# Altium schematic sheet pll_ADF4351.SchDoc
size A3
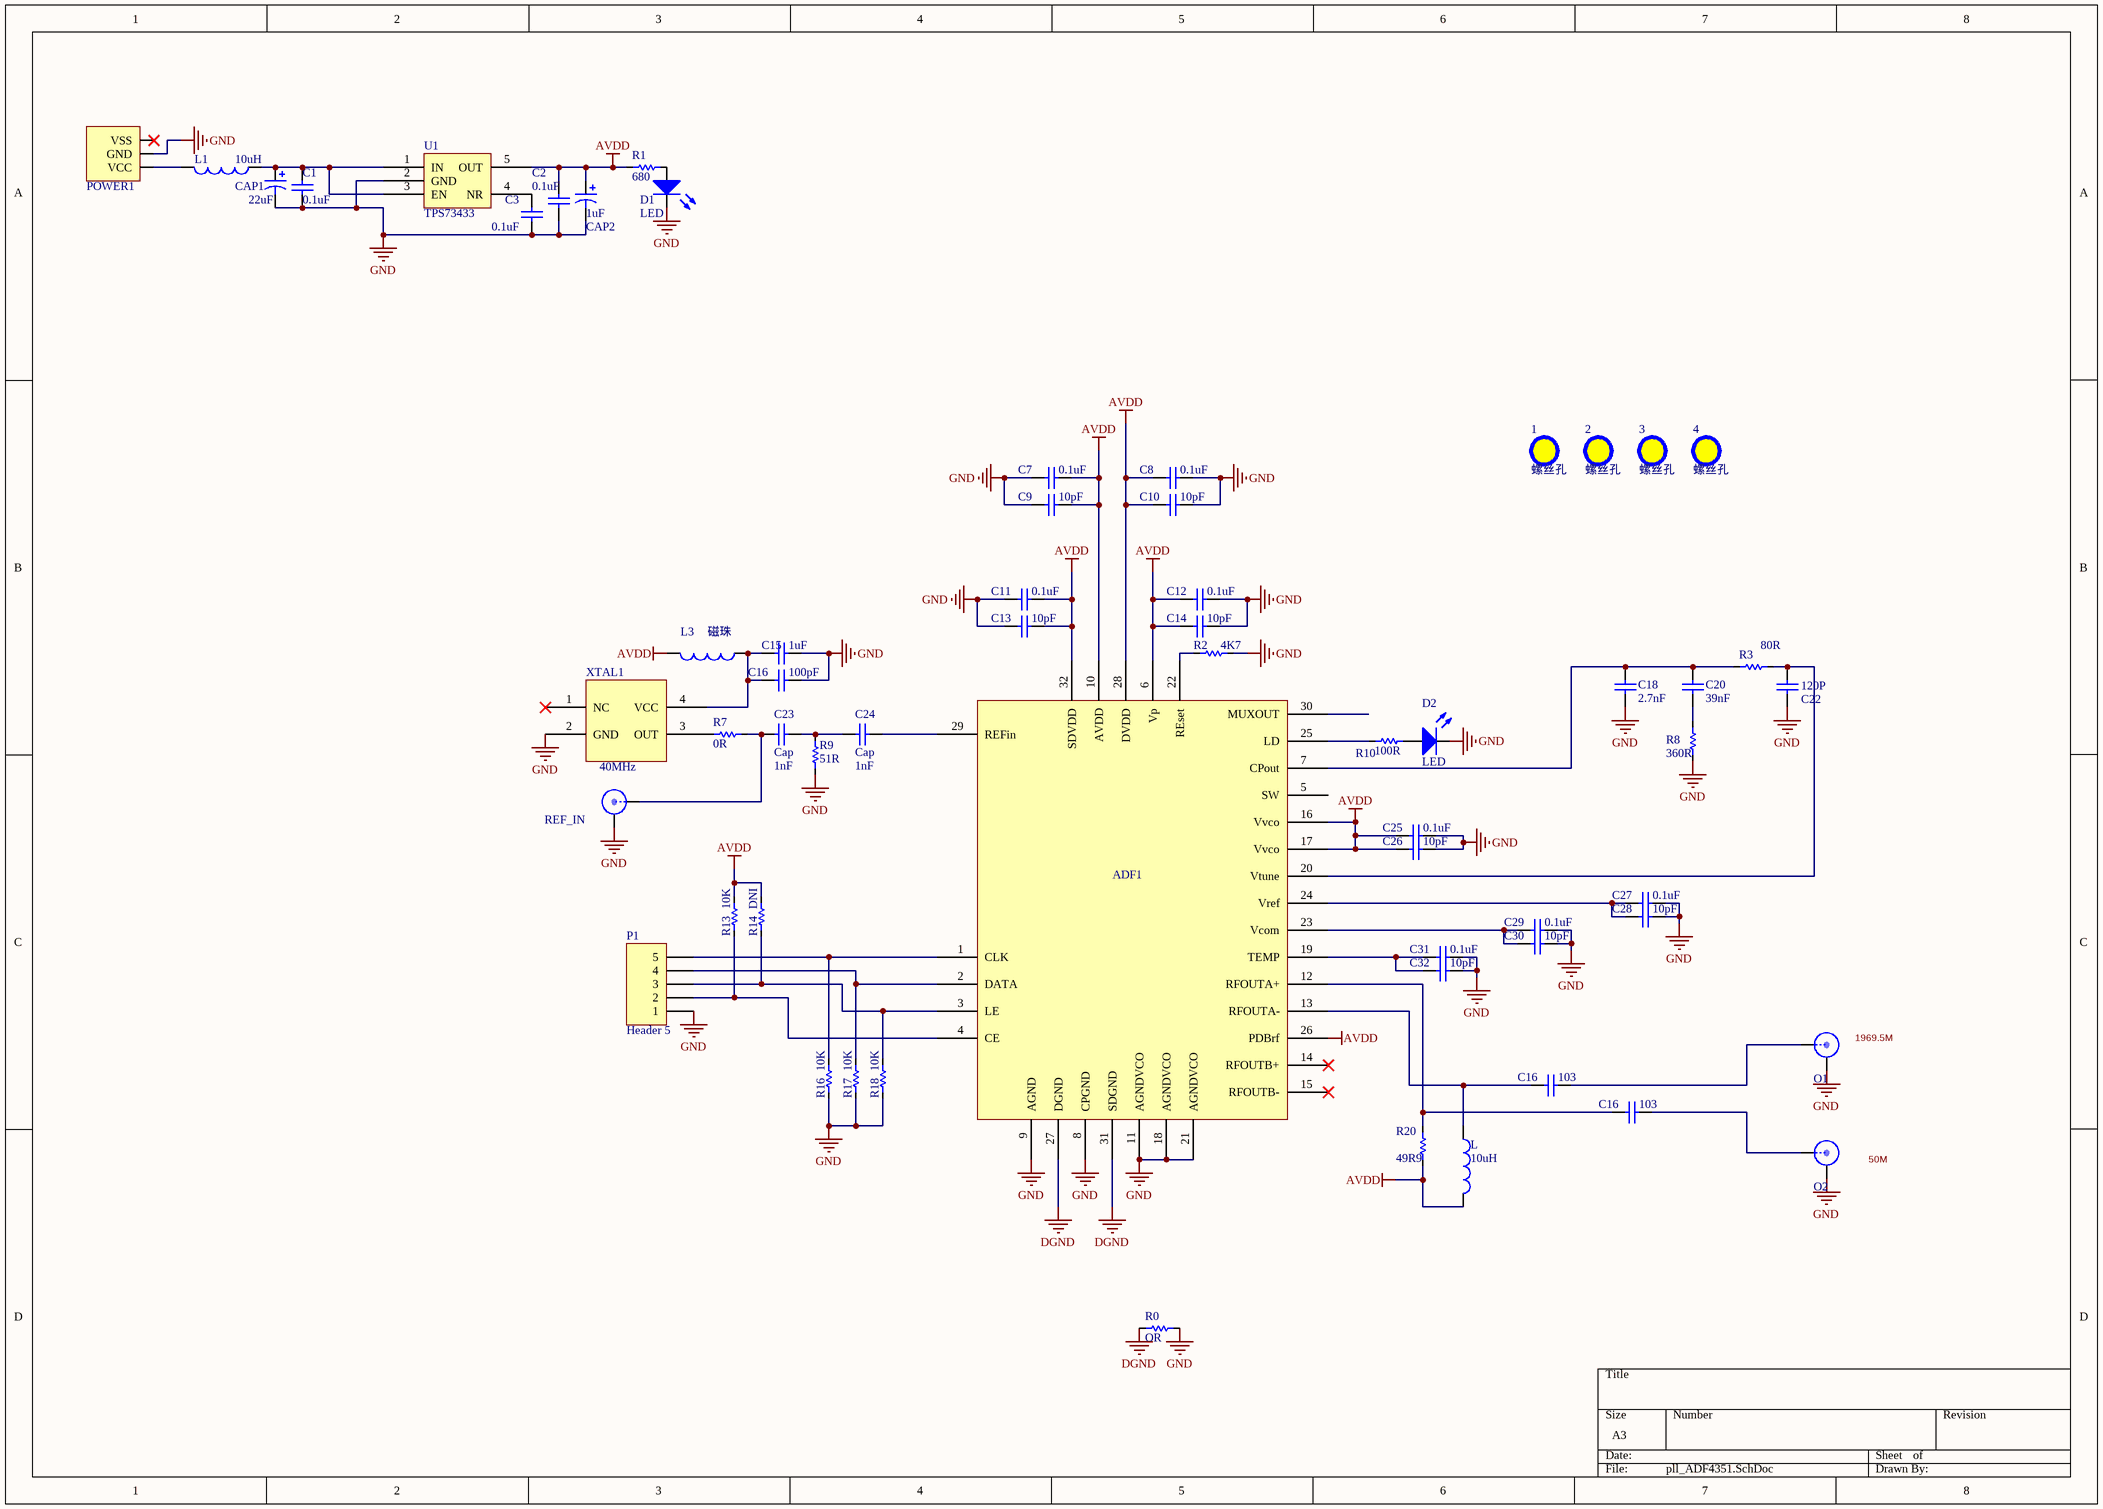
[diagram p0: pll_ADF4351.SchDoc]

## Parts
(Parts that share a designator on the sheet are numbered #1, #2 ... from top to bottom, then left to right.)
1  螺丝孔  [固定过孔]
2  螺丝孔  [固定过孔]
3  螺丝孔  [固定过孔]
4  螺丝孔  [固定过孔]
ADF1  ADF4351  [QFN32]  (value not drawn)
C1  value 0.1uF  [0402 - duplicate]  (hidden comment: Cap)
C2  value 0.1uF  [0402 - duplicate]  (hidden comment: Cap)
C3  value 0.1uF  [0402 - duplicate]  (hidden comment: Cap)
C7  value 0.1uF  [0402 - duplicate]  (hidden comment: Cap)
C8  value 0.1uF  [0402 - duplicate]  (hidden comment: Cap)
C9  value 10pF  [0402 - duplicate]  (hidden comment: Cap)
C10  value 10pF  [0402 - duplicate]  (hidden comment: Cap)
C11  value 0.1uF  [0402 - duplicate]  (hidden comment: Cap)
C12  value 0.1uF  [0402 - duplicate]  (hidden comment: Cap)
C13  value 10pF  [0402 - duplicate]  (hidden comment: Cap)
C14  value 10pF  [0402 - duplicate]  (hidden comment: Cap)
C15  value 1uF  [0402 - duplicate]  (hidden comment: Cap)
C16#1  value 100pF  [0402 - duplicate]  (hidden comment: Cap)
C16#2  value 103  [0402 - duplicate]  (hidden comment: Cap)
C16#3  value 103  [0402 - duplicate]  (hidden comment: Cap)
C18  value 2.7nF  [6-0805_N]  (hidden comment: Cap)
C20  value 39nF  [6-0805_N]  (hidden comment: Cap)
C22  value 120P  [6-0805_N]  (hidden comment: Cap)
C23  Cap  value 1nF  [0402 - duplicate]
C24  Cap  value 1nF  [0402 - duplicate]
C25  value 0.1uF  [0402 - duplicate]  (hidden comment: Cap)
C26  value 10pF  [0402 - duplicate]  (hidden comment: Cap)
C27  value 0.1uF  [0402 - duplicate]  (hidden comment: Cap)
C28  value 10pF  [0402 - duplicate]  (hidden comment: Cap)
C29  value 0.1uF  [0402 - duplicate]  (hidden comment: Cap)
C30  value 10pF  [0402 - duplicate]  (hidden comment: Cap)
C31  value 0.1uF  [0402 - duplicate]  (hidden comment: Cap)
C32  value 10pF  [0402 - duplicate]  (hidden comment: Cap)
CAP1  value 22uF  [钽电容C]  (hidden comment: Cap Pol1)
CAP2  value 1uF  [CAPM3426X20N]  (hidden comment: Cap Pol1)
D1  LED  [LED0805]
D2  LED  [LED0805]
L  value 10uH  [6-0805_N]  (hidden comment: Inductor)
L1  value 10uH  [6-0805_N]  (hidden comment: Inductor)
L3  磁珠  [6-0805_N]
O1  SMA  [SMA Angle]  (value not drawn)
O2  SMA  [SMA Angle]  (value not drawn)
P1  Header 5  [HDR1X5]
POWER1  Power_3Port  [WHITE3_白色电源插座]  (value not drawn)
R0  value OR  [6-0805_N]  (hidden comment: RES)
R1  value 680  [6-0805_N]  (hidden comment: RES)
R2  value 4K7  [6-0805_N]  (hidden comment: RES)
R3  value 80R  [6-0805_N]  (hidden comment: RES)
R7  value 0R  [6-0805_N]  (hidden comment: RES)
R8  value 360R  [6-0805_N]  (hidden comment: RES)
R9  value 51R  [6-0805_N]  (hidden comment: RES)
R10  value 100R  [6-0805_N]  (hidden comment: RES)
R13  value 10K  [6-0805_N]  (hidden comment: RES)
R14  value DNI  [6-0805_N]  (hidden comment: RES)
R16  value 10K  [6-0805_N]  (hidden comment: RES)
R17  value 10K  [6-0805_N]  (hidden comment: RES)
R18  value 10K  [6-0805_N]  (hidden comment: RES)
R20  value 49R9  [0402 - duplicate]  (hidden comment: RES)
REF_IN  SMA  [SMA Stand]  (value not drawn)
U1  TPS73433  [SOT95P280X110-5N]
XTAL1  40MHz  [LCC4 - duplicate]

## Nets
AVDD: ADF1.6(Vp) ADF1.10(AVDD) ADF1.16(Vvco) ADF1.17(Vvco) ADF1.26(PDBrf) ADF1.28(DVDD) ADF1.32(SDVDD) C2.2 C7.1 C8.2 C9.1 C10.2 C11.1 C12.2 C13.1 C14.2 C25.2 C26.2 CAP2.1 L.2 L3.2 R1.2 R13.2 R14.2 R20.1 U1.5(OUT)
DGND: ADF1.27(DGND) ADF1.31(SDGND) R0.2
GND: ADF1.8(CPGND) ADF1.9(AGND) ADF1.11(AGNDVCO) ADF1.18(AGNDVCO) ADF1.21(AGNDVCO) C1.1 C2.1 C3.1 C7.2 C8.1 C9.2 C10.1 C11.2 C12.1 C13.2 C14.1 C15.1 C16#1.1 C18.2 C22.2 C25.1 C26.1 C27.1 C28.1 C29.1 C30.1 C31.1 C32.1 CAP1.2 CAP2.2 D1.2(K) D2.2(K) O1.2 O2.2 P1.1 POWER1.2(GND) R0.1 R2.2 R8.1 R9.1 R16.1 R17.1 R18.1 REF_IN.2 U1.2(GND) XTAL1.2(GND)
NetADF1_1: ADF1.1(CLK) P1.5 R16.2
NetADF1_2: ADF1.2(DATA) P1.4 R17.2
NetADF1_3: ADF1.3(LE) P1.3 R14.1 R18.2
NetADF1_4: ADF1.4(CE) P1.2 R13.1
NetADF1_7: ADF1.7(CPout) C18.1 C20.1 R3.2
NetADF1_12: ADF1.12(RFOUTA+) C16#3.2 R20.2
NetADF1_13: ADF1.13(RFOUTA-) C16#2.2 L.1
NetADF1_19: ADF1.19(TEMP) C31.2 C32.2
NetADF1_20: ADF1.20(Vtune) C22.1 R3.1
NetADF1_22: ADF1.22(REset) R2.1
NetADF1_23: ADF1.23(Vcom) C29.2 C30.2
NetADF1_24: ADF1.24(Vref) C27.2 C28.2
NetADF1_25: ADF1.25(LD) R10.1
NetADF1_29: ADF1.29(REFin) C24.2
NetC1_2: C1.2 CAP1.1 L1.1 U1.1(IN) U1.3(EN)
NetC3_2: C3.2 U1.4(NR)
NetC15_2: C15.2 C16#1.2 L3.1 XTAL1.4(VCC)
NetC16#2_1: C16#2.1 O1.1
NetC16#3_1: C16#3.1 O2.1
NetC20_2: C20.2 R8.2
NetC23_1: C23.1 R7.2 REF_IN.1
NetC23_2: C23.2 C24.1 R9.2
NetD1_1: D1.1(A) R1.1
NetD2_1: D2.1(A) R10.2
NetL1_2: L1.2 POWER1.1(VCC)
NetR7_1: R7.1 XTAL1.3(OUT)

Not connected (* = marked no-connect by the designer): ADF1 5(SW) 14(RFOUTB+)* 15(RFOUTB-)* 30(MUXOUT); POWER1 3(VSS)*; XTAL1 1(NC)*

## Notes on the sheet
- Labels drawn without touching a wire or pin: 50M, 1969.5M

## Library data of the parts
C1-C3 C7-C15 C16#1-C16#3 C18 C20 C22-C32 = Cap: Capacitor; Published: 8-Jun-2000; LatestRevisionDate: 17-Jul-2002; LatestRevisionNote: Re-released for DXP Platform.; PackageReference: RAD-0.3; Publisher: Altium Limited; PackageDescription: Radial Cap, Thru-Hole; 2 Leads; 0.3 in Pin Spacing
CAP1 CAP2 = Cap Pol1: Polarized Capacitor (Radial); Published: 8-Jun-2000; LatestRevisionDate: 17-Jul-2002; LatestRevisionNote: Re-released for DXP Platform.; PackageReference: RB7.6-15; Publisher: Altium Limited; PackageDescription: Polarized Capacitor (Radial); 2 Leads
L L1 = Inductor: Code_IEC: 1005; Published: 8-Jun-2000; LatestRevisionDate: 29-May-2009; LatestRevisionNote: IPC-7351 Footprint Added.; PackageReference: 0402-A; Publisher: Altium Limited; PackageDescription: Chip Inductor; Code_JEITA: 0402
L3 = Inductor: Code_IEC: 1005; Value: 10mH; Published: 8-Jun-2000; LatestRevisionDate: 29-May-2009; LatestRevisionNote: IPC-7351 Footprint Added.; PackageReference: 0402-A; Publisher: Altium Limited; PackageDescription: Chip Inductor; Code_JEITA: 0402
P1 = Header 5: Header, 5-Pin; LatestRevisionDate: 17-Jul-2002; LatestRevisionNote: Re-released for DXP Platform.; Publisher: Altium Limited
POWER1 = Po
XTAL1 = X: SCO-700 1 - 125 MHz 7.0 x 5.0 x 1.6